# Altium schematic sheet Condor2__Power_REV_C.SchDoc
size A4; DrawnBy: Philip Rowse
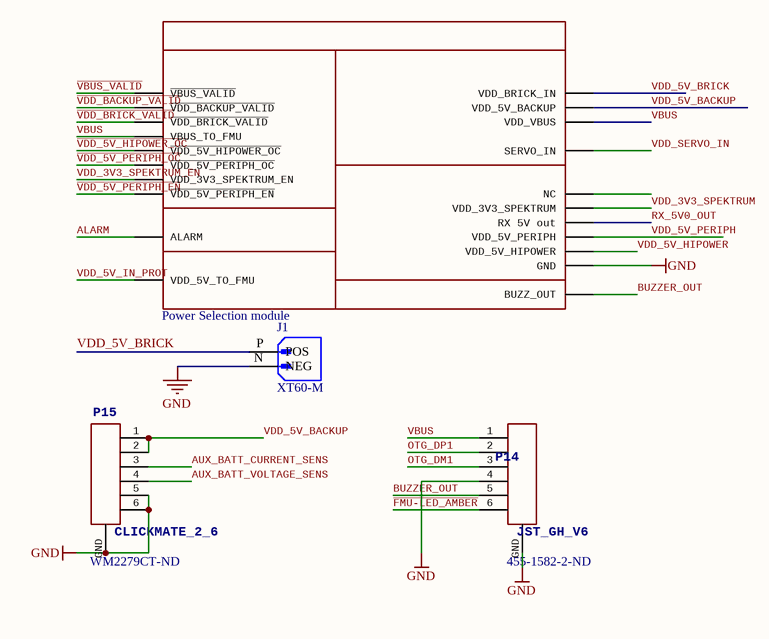
[diagram p0: Condor2__Power_REV_C.SchDoc]

## Parts
J1  XT60-M  [AMASS_XT60-M]
P14  JST_GH_V6  Supplier Part Number 1: 455-1582-2-ND  [JST_GH_V6]
P15  CLICKMATE_2_6  Supplier Part Number 1: WM2279CT-ND  [CLICKMATE_V6_2MM]
PSM1  Power Selection module  [PSM]

## Nets
GND: J1.N(NEG) P14.4 P14.GND P15.5 P15.6 P15.GND PSM1.GND
ALARM: PSM1.ALARM
AUX_BATT_CURRENT_SENS: P15.3
AUX_BATT_VOLTAGE_SENS: P15.4
BUZZER_OUT: P14.5 PSM1.BUZZER_OUT(BUZZ_OUT)
~{FMU-LED_AMBER}: P14.6
OTG_DM1: P14.3
OTG_DP1: P14.2
RX_5V0_OUT: PSM1.RX(RX_5V_out)
~{VBUS_VALID}: PSM1.!VBUS_VALID(~{VBUS_VALID})
~{VDD_5V_HIPOWER_OC}: PSM1.!VDD_5V_HIPOWER_OC(~{VDD_5V_HIPOWER_OC})
~{VDD_5V_PERIPH_EN}: PSM1.!VDD_5V_PERIPH_EN(~{VDD_5V_PERIPH_EN})
~{VDD_5V_PERIPH_OC}: PSM1.!VDD_5V_PERIPH_OC(~{VDD_5V_PERIPH_OC})
~{VDD_BACKUP_VALID}: PSM1.!VDD_BACKUP_VALID(~{VDD_BACKUP_VALID})
~{VDD_BRICK_VALID}: PSM1.!VDD_BRICK_VALID(~{VDD_BRICK_VALID})
VBUS: P14.1 PSM1.VBUS(VBUS_TO_FMU) PSM1.VDD_VBUS
VDD_3V3_SPEKTRUM: PSM1.SPEK(VDD_3V3_SPEKTRUM)
VDD_3V3_SPEKTRUM_EN: PSM1.VDD_3V3_SPEKTRUM_EN
VDD_5V_BACKUP: P15.1 P15.2 PSM1.VDD_5V_BACKUP
VDD_5V_BRICK: J1.P(POS) PSM1.VDD_BRICK_IN
VDD_5V_HIPOWER: PSM1.5V_HIPOWER(VDD_5V_HIPOWER)
VDD_5V_IN_PROT: PSM1.VDD_5V_IN_PROT(VDD_5V_TO_FMU)
VDD_5V_PERIPH: PSM1.5V_PERIPH(VDD_5V_PERIPH)
VDD_SERVO_IN: PSM1.SERVO_IN

Not connected (* = marked no-connect by the designer): PSM1 NC

## Notes on the sheet
- Title:
- Date:
- Time:
- https://creativecommons.org/publicdomain/zero/1.0/
- Sheet:
- Approved:
- of:
- Drawn By:
- Checked By:
- ProfiCNC

## Library data of the parts
J1 = XT60-M: Plug; DC supply; XT60; male; PIN: 2; for cable; soldered; 30A; 500V; MF: AMASS; Price: None; Availability: Not in stock; Package: Package; MP: XT60-M; Value: *; SnapEDA_Link: https://www.snapeda.com/parts/XT60-M/AMASS/view-part/?ref=snap; Check_prices: https://www.snapeda.com/parts/XT60-M/AMASS/view-part/?ref=eda
P14 = JST_GH_V6: BM06B-GHS-TBT; Supplier 1: Digi-Key
P15 = CLICKMATE_2_6: Connector, Header, 6Pos, 2.54MM, Vert, THT, Au; Supplier 1: Digi-Key
PSM1 = PSMPSM: PCA, PSM, Assembly